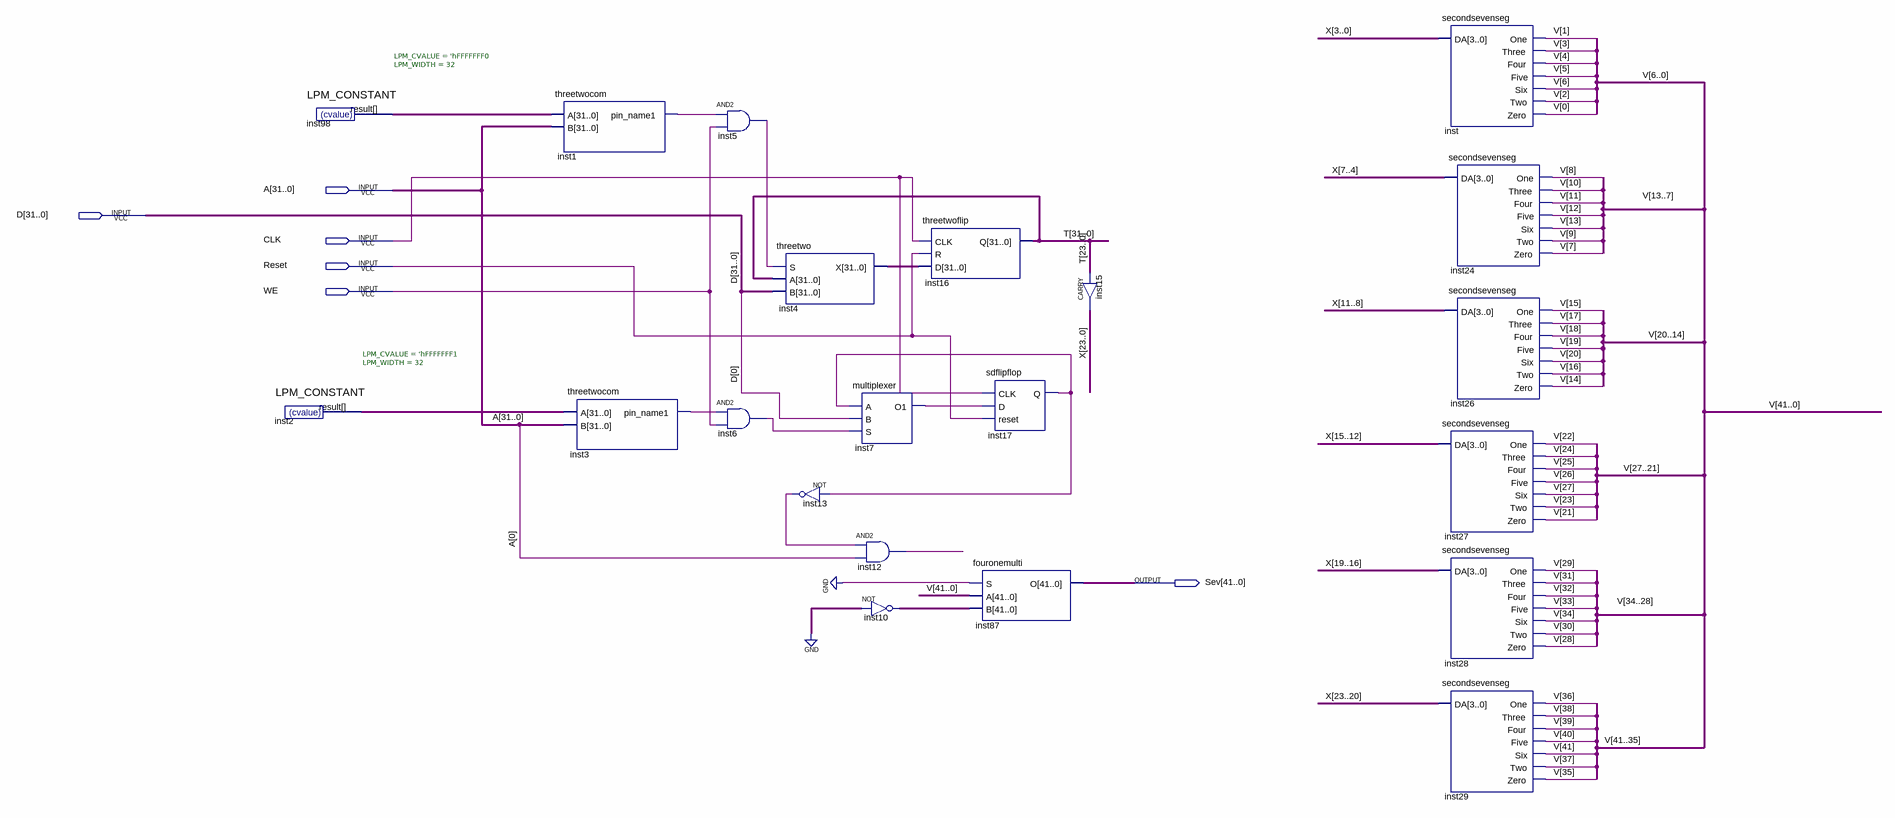
[diagram p0: schematic sheet]
// Quartus schematic leftpart.bdf as structural Verilog: 21 symbols, 6 pins
module leftpart (
  input  [31:0] A,
  input  [31:0] D,
  input  CLK,
  input  Reset,
  input  WE,
  output [41:0] Sev
);

  wire inst1_pin_name1, inst3_pin_name1, inst5_out, inst6_out, inst7_o1, inst12_out, inst13_out, inst17_q;
  wire [23:0] X;
  wire [31:0] inst2_result, inst4_x, inst98_result, T;
  wire [41:0] inst10_out, V;

  LPM_CONSTANT #(.LPM_CVALUE('hFFFFFFF0), .LPM_WIDTH(32)) inst98 (.result(inst98_result));
  LPM_CONSTANT #(.LPM_CVALUE('hFFFFFFF1), .LPM_WIDTH(32)) inst2 (.result(inst2_result));
  threetwocom inst1 (.A(inst98_result), .B(A), .pin_name1(inst1_pin_name1));
  threetwocom inst3 (.A(inst2_result), .B(A), .pin_name1(inst3_pin_name1));
  and inst5 (inst5_out, inst1_pin_name1, WE);
  and inst6 (inst6_out, inst3_pin_name1, WE);
  threetwo inst4 (.S(inst5_out), .A(T), .B(D), .X(inst4_x));
  not inst13 (inst13_out, inst17_q);
  multiplexer inst7 (.A(inst17_q), .B(D[0]), .S(inst6_out), .O1(inst7_o1));
  and inst12 (inst12_out, inst13_out, A[0]);
  assign inst10_out = ~{42{1'b0}};  // NOT inst10, 42 bits wide
  threetwoflip inst16 (.CLK(CLK), .R(Reset), .D(inst4_x), .Q(T));
  sdflipflop inst17 (.CLK(CLK), .D(inst7_o1), .reset(Reset), .Q(inst17_q));
  fouronemulti inst87 (.S(1'b0), .A(V), .B(inst10_out), .O(Sev));
  CARRY inst15[23:0] (.IN(T[23:0]), .OUT(X));
  secondsevenseg inst (
    .DA(X[3:0]), .One(V[1]), .Three(V[3]), .Four(V[4]), .Five(V[5]), .Six(V[6]), .Two(V[2]), .Zero(V[0]));
  secondsevenseg inst24 (
    .DA(X[7:4]), .One(V[8]), .Three(V[10]), .Four(V[11]), .Five(V[12]), .Six(V[13]), .Two(V[9]), .Zero(V[7]));
  secondsevenseg inst26 (
    .DA(X[11:8]), .One(V[15]), .Three(V[17]), .Four(V[18]), .Five(V[19]), .Six(V[20]), .Two(V[16]),
    .Zero(V[14]));
  secondsevenseg inst27 (
    .DA(X[15:12]), .One(V[22]), .Three(V[24]), .Four(V[25]), .Five(V[26]), .Six(V[27]), .Two(V[23]),
    .Zero(V[21]));
  secondsevenseg inst28 (
    .DA(X[19:16]), .One(V[29]), .Three(V[31]), .Four(V[32]), .Five(V[33]), .Six(V[34]), .Two(V[30]),
    .Zero(V[28]));
  secondsevenseg inst29 (
    .DA(X[23:20]), .One(V[36]), .Three(V[38]), .Four(V[39]), .Five(V[40]), .Six(V[41]), .Two(V[37]),
    .Zero(V[35]));
endmodule
